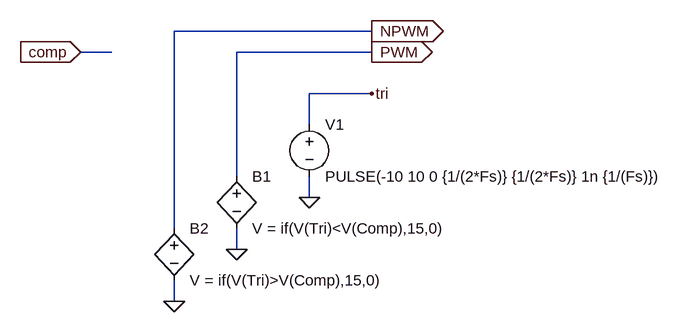
[diagram p0: schematic pwm.asc]
pwm.asc, the LTspice schematic file:
Version 4
SHEET 1 880 680
WIRE 288 32 -16 32
WIRE -112 64 -160 64
WIRE 288 64 80 64
WIRE 288 128 192 128
WIRE 192 176 192 128
WIRE 80 256 80 64
WIRE 192 288 192 256
WIRE -16 336 -16 32
WIRE 80 368 80 336
WIRE -16 448 -16 416
FLAG 192 288 0
FLAG -160 64 comp
IOPIN -160 64 In
FLAG 288 128 tri
FLAG 80 368 0
FLAG 288 64 PWM
IOPIN 288 64 Out
FLAG -16 448 0
FLAG 288 32 NPWM
IOPIN 288 32 Out
SYMBOL voltage 192 160 R0
SYMATTR InstName V1
SYMATTR Value PULSE(-10 10 0 {1/(2*Fs)} {1/(2*Fs)} 1n {1/(Fs)})
SYMBOL bv 80 240 R0
SYMATTR InstName B1
SYMATTR Value V = if(V(Tri)<V(Comp),15,0)
SYMBOL bv -16 320 R0
SYMATTR InstName B2
SYMATTR Value V = if(V(Tri)>V(Comp),15,0)

The netlist it stands for:
* pwm.asc
V1 tri 0 PULSE(-10 10 0 {1/(2*Fs)} {1/(2*Fs)} 1n {1/(Fs)})
B1 PWM 0 V = if(V(Tri)<V(Comp),15,0)
B2 NPWM 0 V = if(V(Tri)>V(Comp),15,0)
.backanno
.end